# Altium schematic sheet 06-multimodal-analogfrontend-PPG.SchDoc
size A; SheetNumber: 4; SheetTotal: 11
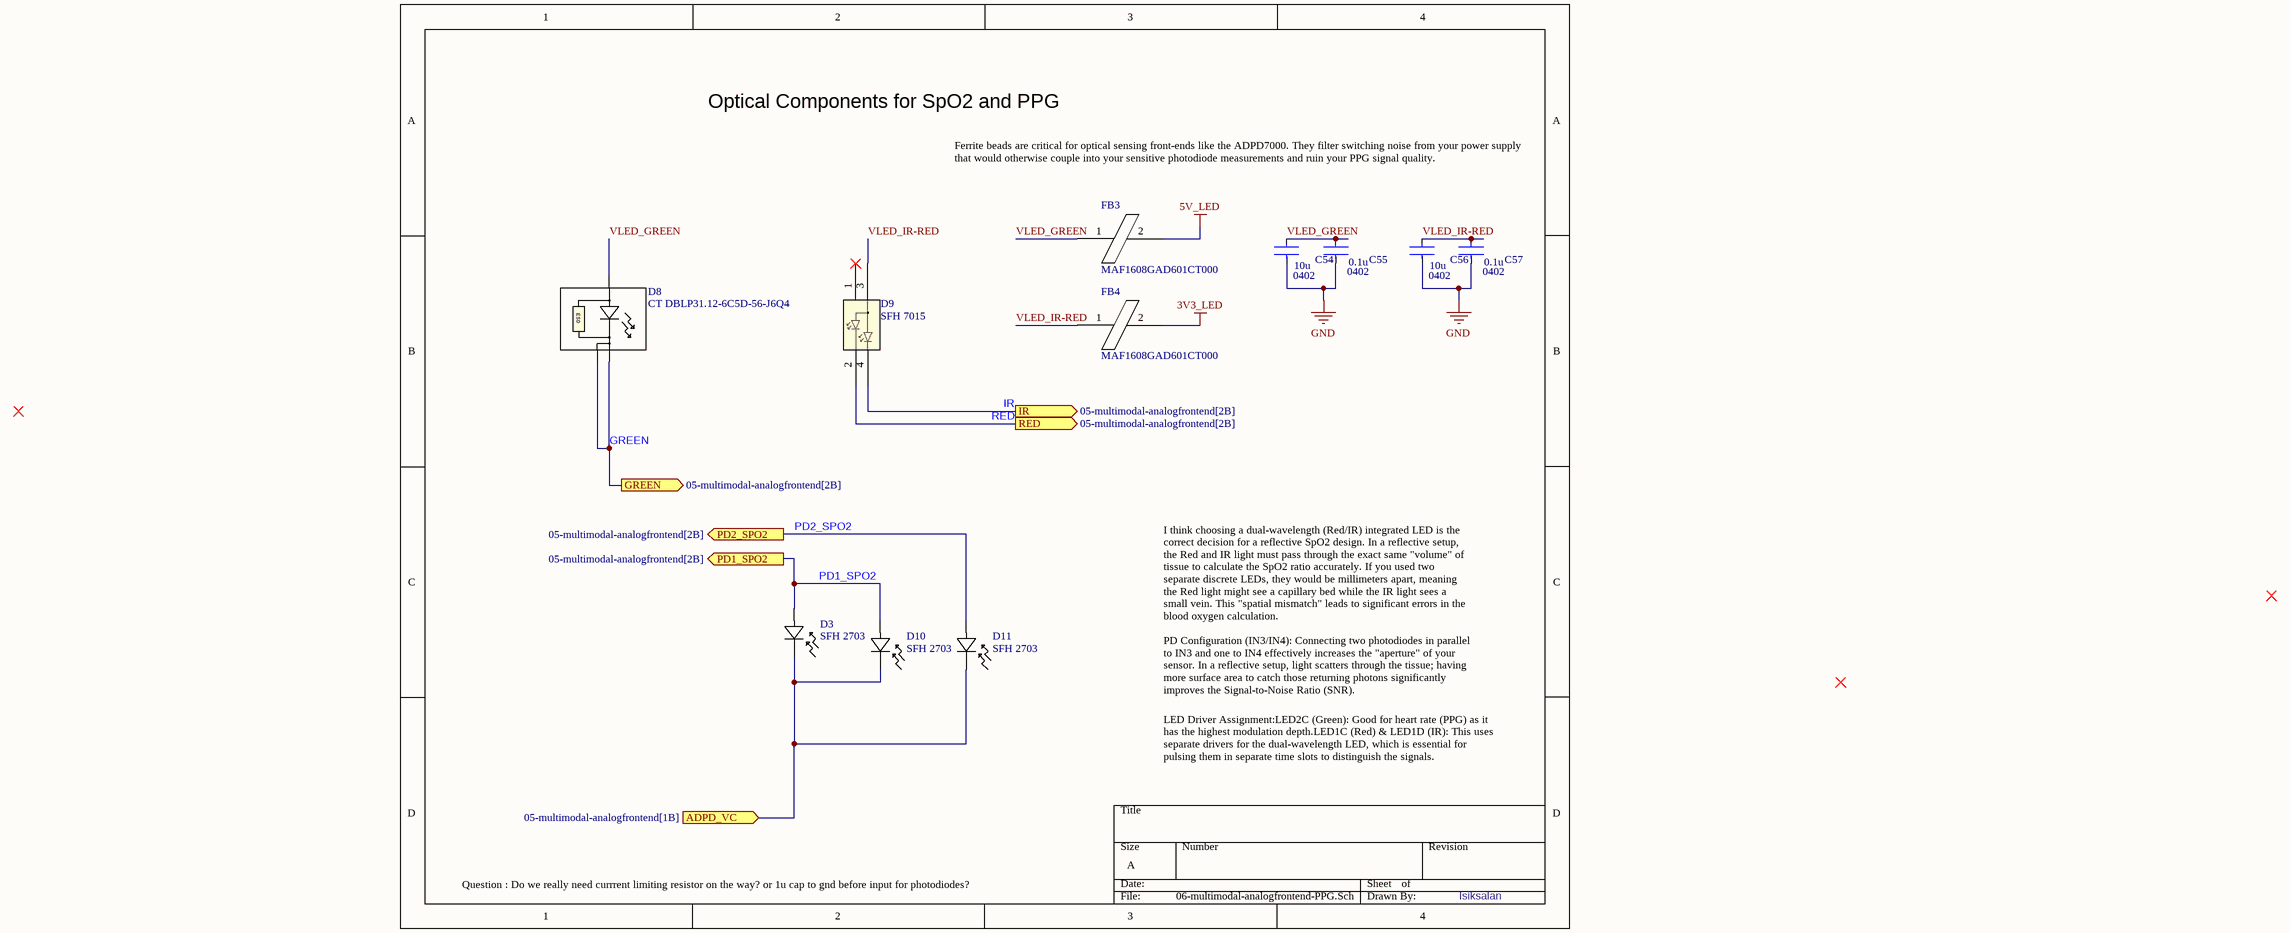
[diagram p0: 06-multimodal-analogfrontend-PPG.SchDoc]

## Parts
C54  0402W106M6R3HI  [CAPTDK0402]  (value not drawn)
C55  C1005X7R1H104K050BB  [CAPTDK0402]  (value not drawn)
C56  0402W106M6R3HI  [CAPTDK0402]  (value not drawn)
C57  C1005X7R1H104K050BB  [CAPTDK0402]  (value not drawn)
D3  SFH 2703  [LED_SFH 2703_OSR]
D8  CT DBLP31.12-6C5D-56-J6Q4  [CT DBLP31.12-6C5D-56-J6Q4_OSR]
D9  SFH 7015  [SFH 7015_OSR]
D10  SFH 2703  [LED_SFH 2703_OSR]
D11  SFH 2703  [LED_SFH 2703_OSR]
FB3  MAF1608GAD601CT000  [INDMURT0603]
FB4  MAF1608GAD601CT000  [INDMURT0603]

## Ports
ADPD_VC (in, see 05-multimodal-analogfrontend[1B]), GREEN (out, see 05-multimodal-analogfrontend[2B]), IR (out, see 05-multimodal-analogfrontend[2B]), PD1_SPO2 (out, see 05-multimodal-analogfrontend[2B]), PD2_SPO2 (out, see 05-multimodal-analogfrontend[2B]), RED (out, see 05-multimodal-analogfrontend[2B])

## Nets
3V3_LED: FB4.2
5V_LED: FB3.2
GND: C54.2 C55.2 C56.2 C57.2
ADPD_VC: D3.1 D10.1 D11.1 ; port ADPD_VC
GREEN: D8.1 D8.3 ; port GREEN
IR: D9.4 ; port IR
PD1_SPO2: D3.2 D10.2 ; port PD1_SPO2
PD2_SPO2: D11.2 ; port PD2_SPO2
RED: D9.2 ; port RED
VLED_GREEN: C54.1 C55.1 D8.2 FB3.1
VLED_IR-RED: C56.1 C57.1 D9.3 FB4.1

Not connected (* = marked no-connect by the designer): D9 1*

## Notes on the sheet
- Optical Components for SpO2 and PPG
- Ferrite beads are critical for optical sensing front-ends like the ADPD7000. They filter switching noise from your power supply that would otherwise couple into your sensitive photodiode measurements and ruin your PPG signal quality.
- I think choosing a dual-wavelength (Red/IR) integrated LED is the correct decision for a reflective SpO2 design. In a reflective setup, the Red and IR light must pass through the exact same "volume" of tissue to calculate the SpO2 ratio accurately. If you used two separate discrete LEDs, they would be millimeters apart, meaning the Red light might see a capillary bed while the IR light sees a small vein. This "spatial mismatch" leads to significant errors in the blood oxygen calculation.
- PD Configuration (IN3/IN4): Connecting two photodiodes in parallel to IN3 and one to IN4 effectively increases the "aperture" of your sensor. In a reflective setup, light scatters through the tissue; having more surface area to catch those returning photons significantly improves the Signal-to-Noise Ratio (SNR).
- LED Driver Assignment:LED2C (Green): Good for heart rate (PPG) as it has the highest modulation depth.LED1C (Red) & LED1D (IR): This uses separate drivers for the dual-wavelength LED, which is essential for pulsing them in separate time slots to distinguish the signals.
- Question : Do we really need currrent limiting resistor on the way? or 1u cap to gnd before input for photodiodes?
- Isiksalan
- (in symbol 0402W106M6R3HI) 10u; 0402
- (in symbol C1005X7R1H104K050BB) 0.1u; 0402
- (in symbol CT DBLP31.12-6C5D-56-J6Q4) ESD

## Library data of the parts
C54 C56 = 0402W106M6R3HI: CAP SMD,0402,X5R,10UF,20%,6.3V
C55 C57 = C1005X7R1H104K050BB: CAP CER 0.1UF 50V X7R 0402; Supplier 1: Digi-Key; Supplier Part Number 1: 445-5932-1-ND
D3 D10 D11 = SFH 2703: SENSOR PHOTODIODE 940NM 2SMD; Manufacturer_Name: ams OSRAM; Copyright: Copyright (C) 2025 Ultra Librarian. All rights reserved.; Manufacturer_Part_Number: SFH 2703; Supplier 1: Avnet; Supplier Part Number 1: Q65112A8147
D8 = CT DBLP31.12-6C5D-56-J6Q4: LED GREEN CLEAR SMD Green 536nm LED Indication - Discrete 2.3V 3-SMD, No Lead; Manufacturer_Name: ams OSRAM; Copyright: Copyright (C) 2025 Ultra Librarian. All rights reserved.; Manufacturer_Part_Number: CT DBLP31.12-6C5D-56-J6Q4; Supplier 1: Avnet; Supplier Part Number 1: Q65112A4607
D9 = SFH 7015: Multi-Color LEDs Red / IR LED 655nm / 940nm; Manufacturer_Name: ams OSRAM; Copyright: Copyright (C) 2026 Ultra Librarian. All rights reserved.; Manufacturer_Part_Number: SFH 7015; RefDes: RefDes; Type: Type; Supplier 1: Avnet; Supplier Part Number 1: Q65113A4161
FB3 FB4 = MAF1608GAD601CT000: FERRITE BEAD 120 OHM 0603 1LN; Supplier 1: Newark; Supplier Part Number 1: MAF1608GAD601CT000